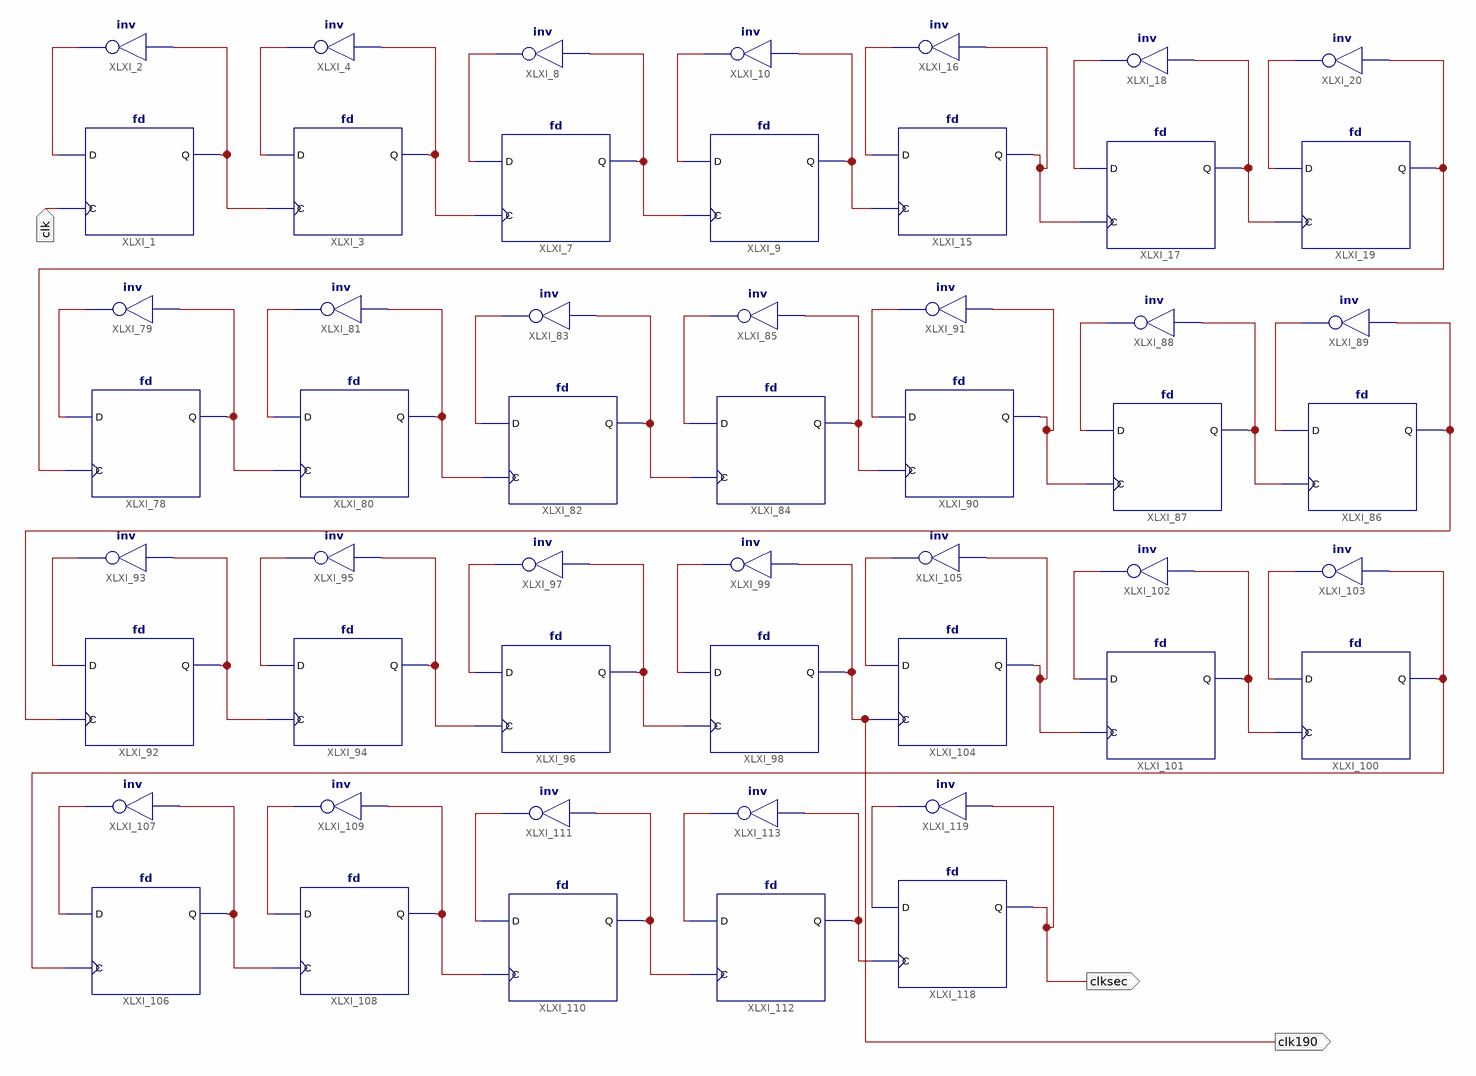
[diagram p0: schematic sheet 1]
// Xilinx ISE schematic clkdiv.sch (spartan3e) as structural Verilog: 52 symbols, 3 ports
module clkdiv (
  input  clk,
  output clksec,
  output clk190
);

  wire XLXN_1, XLXN_2, XLXN_3, XLXN_4, XLXN_8, XLXN_9, XLXN_10, XLXN_11, XLXN_18, XLXN_19, XLXN_20, XLXN_21,
       XLXN_23, XLXN_78, XLXN_84, XLXN_85, XLXN_86, XLXN_87, XLXN_88, XLXN_89, XLXN_90, XLXN_91, XLXN_92,
       XLXN_93, XLXN_94, XLXN_95, XLXN_96, XLXN_98, XLXN_99, XLXN_100, XLXN_101, XLXN_102, XLXN_103,
       XLXN_104, XLXN_106, XLXN_107, XLXN_108, XLXN_109, XLXN_110, XLXN_111, XLXN_113, XLXN_114, XLXN_115,
       XLXN_116, XLXN_117, XLXN_118, XLXN_119, XLXN_120, XLXN_121, XLXN_126;

  fd XLXI_1 (.C(clk), .D(XLXN_2), .Q(XLXN_1));
  not XLXI_2 (XLXN_2, XLXN_1);
  fd XLXI_3 (.C(XLXN_1), .D(XLXN_4), .Q(XLXN_3));
  not XLXI_4 (XLXN_4, XLXN_3);
  fd XLXI_7 (.C(XLXN_3), .D(XLXN_9), .Q(XLXN_8));
  not XLXI_8 (XLXN_9, XLXN_8);
  fd XLXI_9 (.C(XLXN_8), .D(XLXN_11), .Q(XLXN_10));
  not XLXI_10 (XLXN_11, XLXN_10);
  fd XLXI_19 (.C(XLXN_20), .D(XLXN_23), .Q(XLXN_78));
  fd XLXI_17 (.C(XLXN_18), .D(XLXN_21), .Q(XLXN_20));
  not XLXI_18 (XLXN_21, XLXN_20);
  not XLXI_20 (XLXN_23, XLXN_78);
  fd XLXI_15 (.C(XLXN_10), .D(XLXN_19), .Q(XLXN_18));
  not XLXI_16 (XLXN_19, XLXN_18);
  fd XLXI_78 (.C(XLXN_78), .D(XLXN_85), .Q(XLXN_84));
  not XLXI_79 (XLXN_85, XLXN_84);
  fd XLXI_80 (.C(XLXN_84), .D(XLXN_87), .Q(XLXN_86));
  not XLXI_81 (XLXN_87, XLXN_86);
  fd XLXI_82 (.C(XLXN_86), .D(XLXN_89), .Q(XLXN_88));
  not XLXI_83 (XLXN_89, XLXN_88);
  fd XLXI_84 (.C(XLXN_88), .D(XLXN_91), .Q(XLXN_90));
  not XLXI_85 (XLXN_91, XLXN_90);
  fd XLXI_86 (.C(XLXN_92), .D(XLXN_94), .Q(XLXN_95));
  fd XLXI_87 (.C(XLXN_98), .D(XLXN_93), .Q(XLXN_92));
  not XLXI_88 (XLXN_93, XLXN_92);
  not XLXI_89 (XLXN_94, XLXN_95);
  fd XLXI_90 (.C(XLXN_90), .D(XLXN_96), .Q(XLXN_98));
  not XLXI_91 (XLXN_96, XLXN_98);
  fd XLXI_92 (.C(XLXN_95), .D(XLXN_100), .Q(XLXN_99));
  not XLXI_93 (XLXN_100, XLXN_99);
  fd XLXI_94 (.C(XLXN_99), .D(XLXN_102), .Q(XLXN_101));
  not XLXI_95 (XLXN_102, XLXN_101);
  fd XLXI_96 (.C(XLXN_101), .D(XLXN_104), .Q(XLXN_103));
  not XLXI_97 (XLXN_104, XLXN_103);
  fd XLXI_98 (.C(XLXN_103), .D(XLXN_106), .Q(clk190));
  not XLXI_99 (XLXN_106, clk190);
  fd XLXI_100 (.C(XLXN_107), .D(XLXN_109), .Q(XLXN_110));
  fd XLXI_101 (.C(XLXN_113), .D(XLXN_108), .Q(XLXN_107));
  not XLXI_102 (XLXN_108, XLXN_107);
  not XLXI_103 (XLXN_109, XLXN_110);
  fd XLXI_104 (.C(clk190), .D(XLXN_111), .Q(XLXN_113));
  not XLXI_105 (XLXN_111, XLXN_113);
  fd XLXI_106 (.C(XLXN_110), .D(XLXN_115), .Q(XLXN_114));
  not XLXI_107 (XLXN_115, XLXN_114);
  fd XLXI_108 (.C(XLXN_114), .D(XLXN_117), .Q(XLXN_116));
  not XLXI_109 (XLXN_117, XLXN_116);
  fd XLXI_110 (.C(XLXN_116), .D(XLXN_119), .Q(XLXN_118));
  not XLXI_111 (XLXN_119, XLXN_118);
  fd XLXI_112 (.C(XLXN_118), .D(XLXN_121), .Q(XLXN_120));
  not XLXI_113 (XLXN_121, XLXN_120);
  fd XLXI_118 (.C(XLXN_120), .D(XLXN_126), .Q(clksec));
  not XLXI_119 (XLXN_126, clksec);
endmodule
